# Altium project Arduino_7Segments.PrjPcb
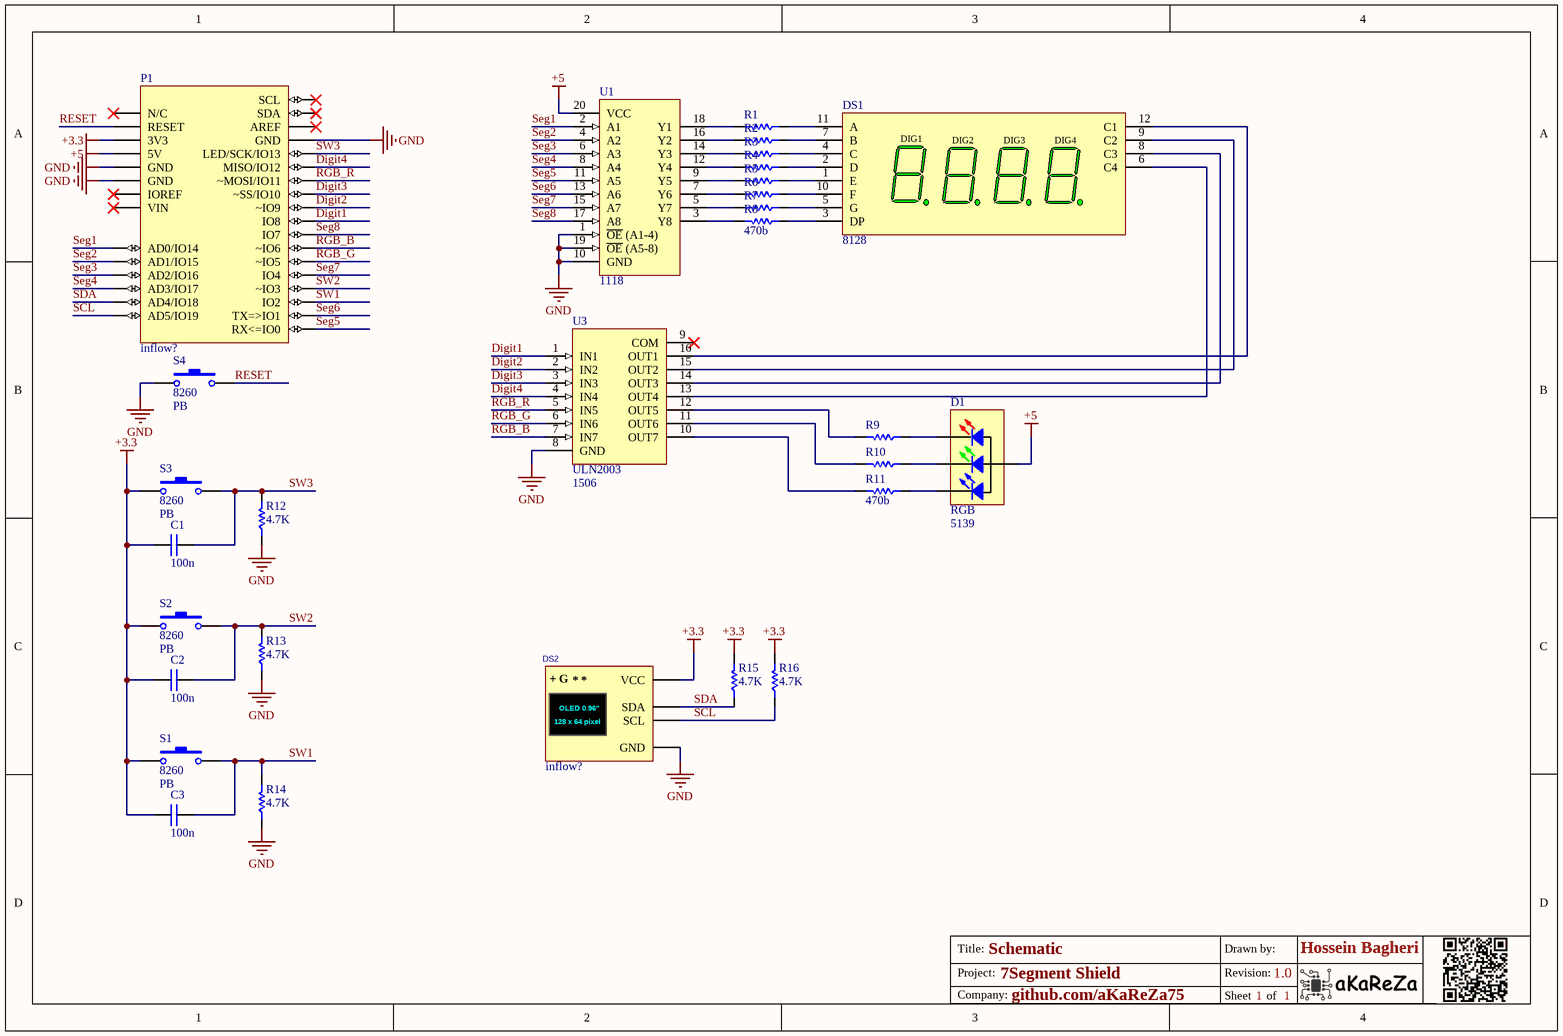
[diagram p0: Sheet1.SchDoc]
CompanyName: github.com/aKaReZa75; Project_Name: 7Segment Shield; Revision: 1.0
1 sheet, 29 parts. Net scope: global (net labels, ports and power ports of the same name join across sheets).
Board file: PCB1.PcbDoc

## Sheet Sheet1.SchDoc: Schematic
size A4; SheetNumber: 1; SheetTotal: 1

### Parts
C1  100n  [Cap - 100nF]
C2  100n  [Cap - 100nF]
C3  100n  [Cap - 100nF]
D1  Inflow: 5139  [RGB_DIP]  (hidden comment: RGB)
DS1  Inflow: 8128  [7Seg-MPX4-30.2x14.1mm]  (hidden comment: 4Digit, Red)
DS2  Inflow: inflow?  [OLED_SSD1306_64_I2C]  (hidden comment: SSD1306)
P1  Inflow: inflow?  [Arduino_uno_S_3]  (hidden comment: UNO)  (no BOM)
R1  470b  [RES 1206 (3216X08L)]  (value not drawn)
R2  470b  [RES 1206 (3216X08L)]  (value not drawn)
R3  470b  [RES 1206 (3216X08L)]  (value not drawn)
R4  470b  [RES 1206 (3216X08L)]  (value not drawn)
R5  470b  [RES 1206 (3216X08L)]  (value not drawn)
R6  470b  [RES 1206 (3216X08L)]  (value not drawn)
R7  470b  [RES 1206 (3216X08L)]  (value not drawn)
R8  470b  [RES 1206 (3216X08L)]
R9  470b  [RES 1206 (3216X08L)]  (value not drawn)
R10  470b  [RES 1206 (3216X08L)]  (value not drawn)
R11  470b  [RES 1206 (3216X08L)]
R12  4.7K  [RES 1206 (3216X08L)]
R13  4.7K  [RES 1206 (3216X08L)]
R14  4.7K  [RES 1206 (3216X08L)]
R15  4.7K  [RES 1206 (3216X08L)]
R16  4.7K  [RES 1206 (3216X08L)]
S1  Inflow: 8260  [SW_PB_SMD_2PIN_SPST_6X3X2]  (hidden comment: PB)
S2  Inflow: 8260  [SW_PB_SMD_2PIN_SPST_6X3X2]  (hidden comment: PB)
S3  Inflow: 8260  [SW_PB_SMD_2PIN_SPST_6X3X2]  (hidden comment: PB)
S4  Inflow: 8260  [SW_PB_SMD_2PIN_SPST_6X3X2]  (hidden comment: PB)
U1  Inflow: 1118  [PDIP20]  (hidden comment: 74HCT244)
U3  Inflow: 1506  [CDIP16]  (hidden comment: ULN2003)

### Nets
+3.3: C1.1 C2.1 C3.1 DS2.1(VCC) P1.4(3V3) R15.2 R16.2 S1.1 S2.1 S3.1
+5: D1.2(CA) P1.5(5V) U1.20(VCC)
GND: DS2.2(GND) P1.6(GND) P1.7(GND) P1.29(GND) R12.1 R13.1 R14.1 S4.1 U1.1(~{OE}_(A1-4)) U1.10(GND) U1.19(~{OE}_(A5-8)) U3.8(GND)
Digit1: P1.23(IO8) U3.1(IN1)
Digit2: P1.24(~IO9) U3.2(IN2)
Digit3: P1.25(~SS/IO10) U3.3(IN3)
Digit4: P1.27(MISO/IO12) U3.4(IN4)
RESET: P1.3(RESET) S4.2
RGB_B: P1.21(~IO6) U3.7(IN7)
RGB_G: P1.20(~IO5) U3.6(IN6)
RGB_R: P1.26(~MOSI/IO11) U3.5(IN5)
SCL: DS2.3(SCL) P1.14(AD5/IO19) R16.1
SDA: DS2.4(SDA) P1.13(AD4/IO18) R15.1
Seg1: P1.9(AD0/IO14) U1.2(A1)
Seg2: P1.10(AD1/IO15) U1.4(A2)
Seg3: P1.11(AD2/IO16) U1.6(A3)
Seg4: P1.12(AD3/IO17) U1.8(A4)
Seg5: P1.15(RX<=IO0) U1.11(A5)
Seg6: P1.16(TX=>IO1) U1.13(A6)
Seg7: P1.19(IO4) U1.15(A7)
Seg8: P1.22(IO7) U1.17(A8)
SW1: C3.2 P1.17(IO2) R14.2 S1.2
SW2: C2.2 P1.18(~IO3) R13.2 S2.2
SW3: C1.2 P1.28(LED/SCK/IO13) R12.2 S3.2
NetD1_1: D1.1(R) R9.1
NetD1_3: D1.3(G) R10.1
NetD1_4: D1.4(B) R11.1
NetDS1_1: DS1.1(E) R5.1
NetDS1_2: DS1.2(D) R4.1
NetDS1_3: DS1.3(DP) R8.1
NetDS1_4: DS1.4(C) R3.1
NetDS1_5: DS1.5(G) R7.1
NetDS1_6: DS1.6(C4) U3.13(OUT4)
NetDS1_7: DS1.7(B) R2.1
NetDS1_8: DS1.8(C3) U3.14(OUT3)
NetDS1_9: DS1.9(C2) U3.15(OUT2)
NetDS1_10: DS1.10(F) R6.1
NetDS1_11: DS1.11(A) R1.1
NetDS1_12: DS1.12(C1) U3.16(OUT1)
NetR1_2: R1.2 U1.18(Y1)
NetR2_2: R2.2 U1.16(Y2)
NetR3_2: R3.2 U1.14(Y3)
NetR4_2: R4.2 U1.12(Y4)
NetR5_2: R5.2 U1.9(Y5)
NetR6_2: R6.2 U1.7(Y6)
NetR7_2: R7.2 U1.5(Y7)
NetR8_2: R8.2 U1.3(Y8)
NetR9_2: R9.2 U3.12(OUT5)
NetR10_2: R10.2 U3.11(OUT6)
NetR11_2: R11.2 U3.10(OUT7)

Not connected (* = marked no-connect by the designer): P1 1(N/C)* 2(IOREF)* 8(VIN)* 30(AREF)* 31(SDA)* 32(SCL)*; U3 9(COM)*

### Notes on the sheet
- Title:
- Project:
- Drawn by:
- Revision:
- Hossein Bagheri
- Company:
- Sheet
- of
- (in symbol ModSen_7Seg_MPX4_CC) DIG1; DIG2; DIG3; DIG4
- (in symbol ModSen_LCD_Oled_0.96_2) +; G; OLED 0.96"; 128 x 64 pixel

### Library data of the parts
C1-C3 = Cap_Multi_THT: Multi layer capacitor; Inflow: inflow?; Type: Type?; Validation: Valid; Rating: Rating?; Package: Package?; Value: 100n
D1 = Semi_LED_RGB_THT: SMD 5050 LED RGB and Other; Rating: 5V; Type: CA; Validation: Valid; Package: Dip; Value: RGB
DS1 = ModSen_7Seg_MPX4_CC: 7Segment-MPX4-CC; Rating: Rating?; Type: Type?; Value: 4Digit, Red; Package: Package?
DS2 = ModSen_LCD_Oled_0.96_2: Oled Display; Rating: 128x64; Validation: Valid; Value: SSD1306; Type: OLED; Package: 0.96
P1 = Con_Arduino_UNO_S: Arduino uno slave; Rating: Rating?; Value: UNO; Package: Package?; Type: Type?
R1-R16 = Res_SMD_1206: Resistor; Inflow: inflow?; Rating: 0.25W; Validation: Valid; Package: 1206; Type: 10%
  R1-R11: Value: 470b
  R12-R16: Value: 4.7K
S1-S4 = SW_PushButton_2_SMD: SMT Tactile ‎Switch; Rating: 2b; Type: Vertical; Package: SMD; Value: PB
U1 = IC_Logic_74HCT244: Octal Bus Buffer with 3 State Outputs (Non Inverted); Rating: 8b; Type: 3-State Non-Inverting; Package: Dip; Value: 74HCT244
U3 = IC_Driver_ULN2003: Seven darlington array drivers; Rating: Rating?; Validation: Valid; Package: SO-16; Type: Driver; Value: ULN2003